# EAGLE design scd4x_rf-bm-2652p2 (EAGLE 9.6.2)
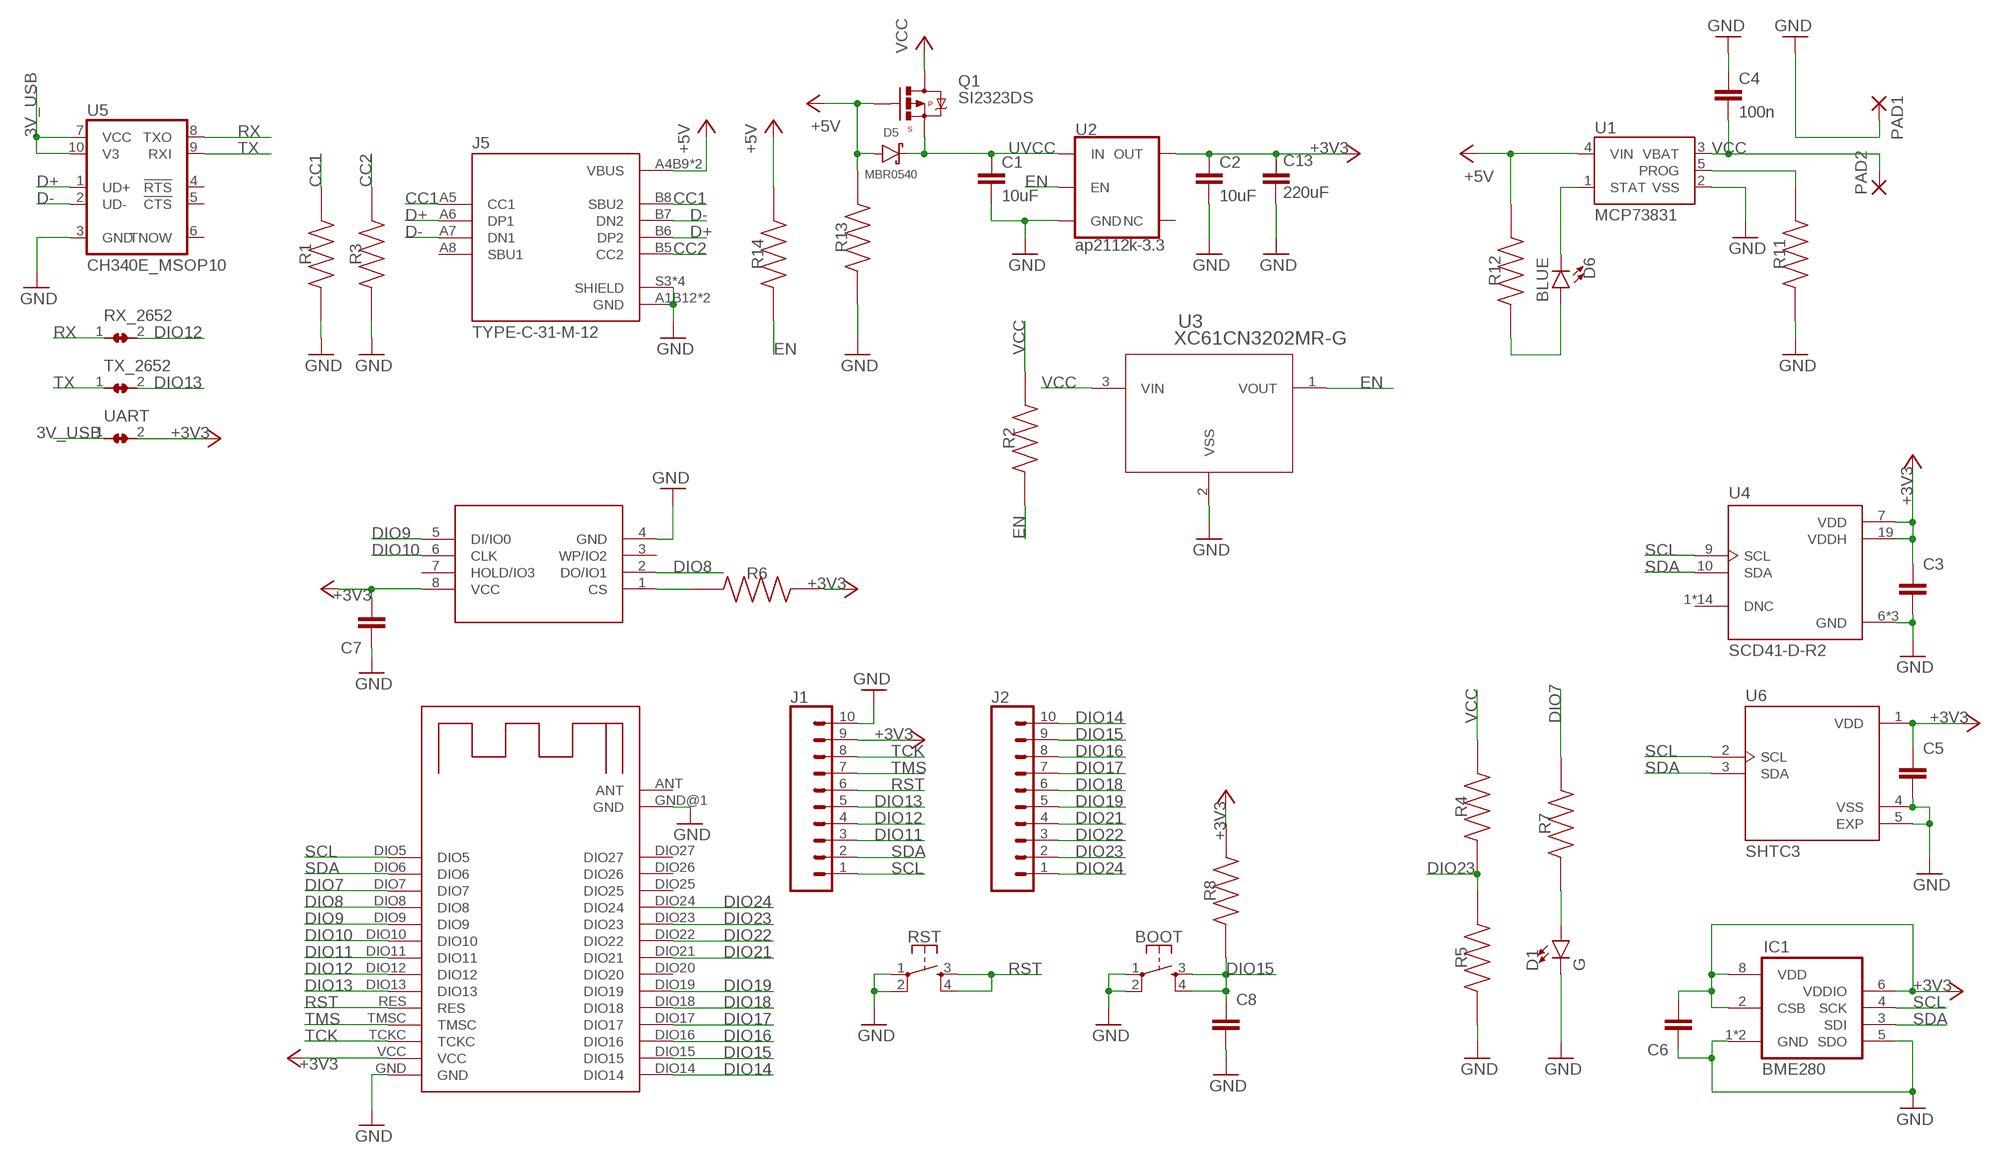
[diagram p0: schematic, sheet 1]

## Parts
BOOT  MOMENTARY-SWITCH-SPST-2-SMD-4.6X2.8MM  [TACTILE_SWITCH_SMD_4.6X2.8MM]
C1  10uF  10UF-0603-6.3V-20%  [0603]
C2  10uF  10UF-0603-6.3V-20%  [0603]
C3  100nF  CAP0402  [CAPC1005X40N]
C4  100n  10UF-0603-6.3V-20%  [0603]
C5  100nF  CAP0402  [CAPC1005X40N]
C6  100nF  CAP0402  [CAPC1005X40N]
C7  100n  CAP0402  [CAPC1005X40N]
C8  100nF  CAP0402  [CAPC1005X40N]
C13  220uF  C_TANTALUM-2917(7343-METRIC)  [CAPM7343X310]
D1  G  LED-BLUE0603  [LED-0603]
D5  MBR0540  DIODE-SCHOTTKY  [SOD-323]
D6  BLUE  LED-BLUE0603  [LED-0603]
IC1  BME280  [BME280]
J1  CONN_10NO_SILK_PTH_FEMALE  [1X10_NO_SILK]
J2  CONN_10NO_SILK_PTH_FEMALE  [1X10_NO_SILK]
J5  TYPE-C-31-M-12  [HRO_TYPE-C-31-M-12]
PAD1  WIREPADSMD1,27-254  [SMD1,27-2,54]
PAD2  WIREPADSMD1,27-254  [SMD1,27-2,54]
Q1  SI2323DS  MOSFET-PCHANNEL  [SOT23]
R1  5.1k  RC0402FR-073M6L  [RESC1005X40N]
R2  10k  RC0402FR-073M6L  [RESC1005X40N]
R3  5.1k  RC0402FR-073M6L  [RESC1005X40N]
R4  382k  RC0402FR-073M6L  [RESC1005X40N]
R5  382k  RC0402FR-073M6L  [RESC1005X40N]
R6  2.2k  RC0402FR-073M6L  [RESC1005X40N]
R7  2.2k  RC0402FR-073M6L  [RESC1005X40N]
R8  5.1M  RC0402FR-073M6L  [RESC1005X40N]
R11  2k  RC0402FR-073M6L  [RESC1005X40N]
R12  2.2k  RC0402FR-073M6L  [RESC1005X40N]
R13  100k  RC0402FR-073M6L  [RESC1005X40N]
R14  10k  RC0402FR-073M6L  [RESC1005X40N]
RST  MOMENTARY-SWITCH-SPST-2-SMD-4.6X2.8MM  [TACTILE_SWITCH_SMD_4.6X2.8MM]
RX_2652  RX_2652  SMALL_SOLDER_JUMPER_CLOSED  [SMALL_SOLDER_JUMPER_CLOSED]
TX_2652  TX_2652  SMALL_SOLDER_JUMPER_CLOSED  [SMALL_SOLDER_JUMPER_CLOSED]
U1  MCP73831  [SOT23-5]
U2  ap2112k-3.3  V_REG_AP2112K-3.3V  [SOT23-5]
U3  XC61CN3202MR-G  [XC61C_SOT-23_TOR]
U4  SCD41-D-R2  [XDCR_SCD41-D-R2]
U5  CH340E_MSOP10  [MSOP10]
U6  SHTC3  [SON100P200X200X80-5N]
U$1  RF-BM-2652P2  [RF-BM-2652P2]
U$3  MX25R8035FM1IL0  W25Q80BVSNIG  [SO-8]
UART  UART  SMALL_SOLDER_JUMPER_CLOSED  [SMALL_SOLDER_JUMPER_CLOSED]

## Nets
3V_USB: U5.7(VCC) U5.10(V3) UART.1
+3V3: C2.1 C3.1 C5.1 C6.2 C7.2 C13.1 IC1.2(CSB) IC1.6(VDDIO) IC1.8(VDD) J1.9 R6.2 R8.2 U2.5(OUT) U4.7(VDD) U4.19(VDDH) U6.1(VDD) U$1.VCC U$3.8(VCC) UART.2
+5V: D5.A J5.A4B9(VBUS) J5.B4A9(VBUS) Q1.1(G) R12.2 R13.2 R14.2 U1.4(VIN)
CC1: J5.A5(CC1) J5.B8(SBU2) R1.2
CC2: J5.B5(CC2) R3.2
D+: J5.A6(DP1) J5.B6(DP2) U5.1(UD+)
D-: J5.A7(DN1) J5.B7(DN2) U5.2(UD-)
DIO7: R7.2 U$1.DIO7
DIO8: U$1.DIO8 U$3.2(DO/IO1)
DIO9: U$1.DIO9 U$3.5(DI/IO0)
DIO10: U$1.DIO10 U$3.6(CLK)
DIO11: J1.3 U$1.DIO11
DIO12: J1.4 RX_2652.2 U$1.DIO12
DIO13: J1.5 TX_2652.2 U$1.DIO13
DIO14: J2.10 U$1.DIO14
DIO15: BOOT.3 BOOT.4 C8.1 J2.9 R8.1 U$1.DIO15
DIO16: J2.8 U$1.DIO16
DIO17: J2.7 U$1.DIO17
DIO18: J2.6 U$1.DIO18
DIO19: J2.5 U$1.DIO19
DIO21: J2.4 U$1.DIO21
DIO22: J2.3 U$1.DIO22
DIO23: J2.2 R4.1 R5.2 U$1.DIO23
DIO24: J2.1 U$1.DIO24
EN: R2.1 R14.1 U2.3(EN) U3.1(VOUT)
GND: BOOT.1 BOOT.2 C1.2 C2.2 C3.2 C4.1 C5.2 C6.1 C7.1 C8.2 C13.2 D1.C IC1.1(GND) IC1.5(SDO) IC1.7(GND) J1.10 J5.A1B12(GND) J5.B1A12(GND) J5.S3(SHIELD) J5.S4(SHIELD) J5.S5(SHIELD) J5.S6(SHIELD) PAD1.1(P) R1.1 R3.1 R5.1 R11.1 R13.1 RST.1 RST.2 U1.2(VSS) U2.2(GND) U3.2(VSS) U4.6(GND) U4.20(GND) U4.21(GND) U5.3(GND) U6.4(VSS) U6.5(EXP) U$1.GND U$1.GND@1(GND) U$3.4(GND)
N$1: D1.A R7.1
N$2: R6.1 U$3.1(CS)
N$8: R11.2 U1.5(PROG)
N$9: D6.A R12.1
N$11: D6.C U1.1(STAT)
RST: J1.6 RST.3 RST.4 U$1.RES
RX: RX_2652.1 U5.8(TXO)
SCL: IC1.4(SCK) J1.1 U4.9(SCL) U6.2(SCL) U$1.DIO5
SDA: IC1.3(SDI) J1.2 U4.10(SDA) U6.3(SDA) U$1.DIO6
TCK: J1.8 U$1.TCKC
TMS: J1.7 U$1.TMSC
TX: TX_2652.1 U5.9(RXI)
UVCC: C1.1 D5.C Q1.2(S) U2.1(IN)
VCC: C4.2 PAD2.1(P) Q1.3(D) R2.2 R4.2 U1.3(VBAT) U3.3(VIN)
Unconnected: J5.A8(SBU1) U2.4(NC) U4.1(DNC) U4.2(DNC) U4.3(DNC) U4.4(DNC) U4.5(DNC) U4.8(DNC) U4.11(DNC) U4.12(DNC) U4.13(DNC) U4.14(DNC) U4.15(DNC) U4.16(DNC) U4.17(DNC) U4.18(DNC) U5.4(!RTS) U5.5(!CTS) U5.6(TNOW) U$1.ANT U$1.DIO20 U$1.DIO25 U$1.DIO26 U$1.DIO27 U$3.3(WP/IO2) U$3.7(HOLD/IO3)

## Library data of the parts
BOOT RST = SparkFun-Switches:MOMENTARY-SWITCH-SPST-2: Momentary Switch (Pushbutton) - SPST - Two Circuits Normally-open (NO) SPST momentary switches (buttons, pushbuttons). Schematic symbol includes two switch circuits. Variants SMD-4.6MMX2.8MM - 4.60mm x 2.80mm Tactile Momentary Button Switch - Used on SparkFun SAMD21 Mini Breakout <https://www.sparkfun.com/products/13664> SMD-5.2MM - Mini Pushbutton Switch - SMD <https://www.sparkfun.com/products/8720> - Used on Arduino Pro Mini <https://www.sparkfun.com/products/11114>; PROD_ID: SWCH-13065
C1 C2 = SparkFun-Capacitors:10UF: 10.0µF ceramic capacitors A capacitor is a passive two-terminal electrical component used to store electrical energy temporarily in an electric field.; PROD_ID: CAP-11015
C3 C5-C8 = discretes-dev:CAP0402: CAP, 0402; AVAILABILITY: Good; DESCRIPTION: RESISTOR, 0402 0.063W 1% 3M6; Resistance:3.6Mohm; Resistance Tolerance:± 1%; Power Rating:0.063W; Voltage Rating:50V; Series:RC32H; Temperature Coefficient:± 100ppm/°C; Resistor Element Type:Thick Film; Resistor Case Style:0402; No. of Pins:2; SVHC:No SVHC; Case Style:0402; External Length / Height:1mm; Temperature Coeff. +:100ppm/°C; Temperature Coeff. -:100ppm/°C; External Depth:0.35mm; External Width:0.5mm; Operating Temperature Range:-55°C to +155°C; Overload Voltage:100V; MF: Yageo; MP: RC0402FR-073M6L; PACKAGE: 1005 Panasonic Electronic Components; PRICE: None; PURCHASE-URL: https://pricing.snapeda.com/search/part/RC0402FR-073M6L/?ref=eda
C4 = SparkFun-Capacitors:10UF: 10.0µF ceramic capacitors A capacitor is a passive two-terminal electrical component used to store electrical energy temporarily in an electric field.; PROD_ID: CAP-11015; VALUE: 10uF
C13 = Capacitor:C: Capacitor - Generic; CATEGORY: Capacitor
D1 = SparkFun-LED:LED-BLUE: Blue SMD LED Used in manufacturing of various products at SparkFun Packages: 0603 - SMD 0603 package [Product Link] <http://www.digikey.com/product-detail/en/SMLE12BC7TT86/511-1589-2-ND/1641808> 1206 - SMD1206 package [Product Link] <http://www.digikey.com/product-detail/en/lite-on-inc/LTST-C150TBKT/160-1643-1-ND/573584> SparkFun Products: ESP8266 Thing-Dev Board <https://www.sparkfun.com/products/13711> RedBoard <https://www.sparkfun.com/products/12757>; PROD_ID: DIO-08575; VALUE: BLUE
D5 = pimoroni-passives:DIODE-SCHOTTKY
D6 = SparkFun-LED:LED-BLUE: Blue SMD LED Used in manufacturing of various products at SparkFun Packages: 0603 - SMD 0603 package [Product Link] <http://www.digikey.com/product-detail/en/SMLE12BC7TT86/511-1589-2-ND/1641808> 1206 - SMD1206 package [Product Link] <http://www.digikey.com/product-detail/en/lite-on-inc/LTST-C150TBKT/160-1643-1-ND/573584> SparkFun Products: ESP8266 Thing-Dev Board <https://www.sparkfun.com/products/13711> RedBoard <https://www.sparkfun.com/products/12757>; PROD_ID: DIO-08575
IC1 = bosch-bme280:BME280: DIGITAL HUMIDITY, PRESSURE AND TEMPERATURE SENSOR * Digital interface I²C (up to 3.4 MHz) and SPI (3 and 4 wire, up to 10 MHz)* Supply voltage VDD main supply voltage range: 1.71 V to 3.6 V*VDDIO interface voltage range: 1.2 V to 3.6 V Operating range -40…+85 °C, 0…100 % rel. humidity, 300…1100 hPa The library has been designed by Richard Magdycz <https://www.facebook.com/groups/eaglecadsoftUK>
J1 J2 = SparkFun-Connectors2:CONN_10: Multi connection point. Often used as Generic Header-pin footprint for 0.1 inch spaced/style header connections On any of the 0.1 inch spaced packages, you can populate with these: Break Away Headers - Straight <https://www.sparkfun.com/products/116> (PRT-00116) Break Away Male Headers - Right Angle <https://www.sparkfun.com/products/553> (PRT-00553) Female Headers <https://www.sparkfun.com/products/115> (PRT-00115) Break Away Headers - Machine Pin <https://www.sparkfun.com/products/117> (PRT-00117) Break Away Female Headers - Swiss Machine Pin <https://www.sparkfun.com/products/743> (PRT-00743) Arduino Stackable Header - 10 Pin <https://www.sparkfun.com/products/11376> (PRT-11376) For SCREWTERMINALS and SPRING TERMINALS visit here: Screw Terimnals on SparkFun.com <https://www.sparkfun.com/search/results?term=Screw+Terminals> (5mm/3.5mm/2.54mm spacing) This device is also useful as a general connection point to wire up your design to another part of your project. Our various solder wires solder well into these plated through hole pads. Hook-Up Wire - Assortment (Stranded, 22 AWG) <https://www.sparkfun.com/products/11375> (PRT-11375) Hook-Up Wire - Assortment (Solid Core, 22 AWG) <https://www.sparkfun.com/products/11367> (PRT-11367) View the entire wire category on our website here <https://www.sparkfun.com/categories/141> Special notes: Molex polarized connector foot print use with SKU : PRT-08231 with associated crimp pins and housings. 1MM SMD Version SKU: PRT-10208 NOTES ON THE VARIANTS LOCK and LOCK_LONGPADS... This footprint was designed to help hold the alignment of a through-hole component (i.e. 6-pin header) while soldering it into place. You may notice that each hole has been shifted either up or down by 0.005 of an inch from it's more standard position (which is a perfectly straight line). This slight alteration caused the pins (the squares in the middle) to touch the edges of the holes. Because they are alternating, it causes a "brace" to hold the component in place. 0.005 has proven to be the perfect amount of "off-center" position when using our standard breakaway headers. Although looks a little odd when you look at the bare footprint, once you have a header in there, the alteration is very hard to notice. Also,if you push a header all the way into place, it is covered up entirely on the bottom side.; PROD_ID: CONN-11563
J5 = TYPE-C-31-M-12:TYPE-C-31-M-12: USB Connectors 24 Receptacle 1 8.94*7.3mm RoHS Check availability <https://pricing.snapeda.com/parts/TYPE-C-31-M-12/HRO%20Electronics%20Co.%2C%20Ltd./view-part?ref=eda>; AVAILABILITY: Not in stock; DESCRIPTION: USB Connectors 24 Receptacle 1 8.94*7.3mm RoHS; MF: HRO Electronics Co., Ltd.; MP: TYPE-C-31-M-12; PACKAGE: Package; PRICE: None
PAD1 PAD2 = wirepad:WIREPAD: Wire PAD connect wire on PCB
Q1 = pimoroni-passives:MOSFET-PCHANNEL: Generic PMOSFET
R1-R8 R11-R14 = RC0402FR-073M6L:RC0402FR-073M6L: RESISTOR, 0402 0.063W 1% 3M6; Resistance:3.6Mohm; Resistance Tolerance:± 1%; Power Rating:0.063W; Voltage Rating:50V; Series:RC32H; Temperature Coefficient:± 100ppm/°C; Resistor Element Type:Thick Film; Resistor Case Style:0402; No. of Pins:2; SVHC:No SVHC; Case Style:0402; External Length / Height:1mm; Temperature Coeff. +:100ppm/°C; Temperature Coeff. -:100ppm/°C; External Depth:0.35mm; External Width:0.5mm; Operating Temperature Range:-55°C to +155°C; Overload Voltage:100V Check prices <https://pricing.snapeda.com/parts/RC0402FR-073M6L/Yageo/view-part?ref=eda>; AVAILABILITY: Good; DESCRIPTION: RESISTOR, 0402 0.063W 1% 3M6; Resistance:3.6Mohm; Resistance Tolerance:± 1%; Power Rating:0.063W; Voltage Rating:50V; Series:RC32H; Temperature Coefficient:± 100ppm/°C; Resistor Element Type:Thick Film; Resistor Case Style:0402; No. of Pins:2; SVHC:No SVHC; Case Style:0402; External Length / Height:1mm; Temperature Coeff. +:100ppm/°C; Temperature Coeff. -:100ppm/°C; External Depth:0.35mm; External Width:0.5mm; Operating Temperature Range:-55°C to +155°C; Overload Voltage:100V; MF: Yageo; MP: RC0402FR-073M6L; PACKAGE: 1005 Panasonic Electronic Components; PRICE: None; PURCHASE-URL: https://pricing.snapeda.com/search/part/RC0402FR-073M6L/?ref=eda
RX_2652 TX_2652 UART = pimoroni-misc:SMALL_SOLDER_JUMPER_CLOSED
U1 = SparkFun-IC-Power:MCP73831: MCP73831T Li-Ion, Li-Pol Controller Miniature single cell, fully integrated Li-Ion, Li-polymer charge management controller Datasheet <http://ww1.microchip.com/downloads/en/DeviceDoc/20001984g.pdf> SparkFun Products: SparkFun ESP32 Thing <https://www.sparkfun.com/products/13907> SparkFun 9DoF Razor IMU M0 <https://www.sparkfun.com/products/14001>; PROD_ID: IC-09995
U2 = SparkFun-IC-Power:V_REG_AP2112: AP2112 - 600mA CMOS LDO Regulator w/ Enable The AP2112 is CMOS process low dropout linear regulator with enable function, the regulator delivers a guaranteed 600mA (min.) continuous load current. Features Output Voltage Accuracy: ±1.5% Output Current: 600mA (Min.) Foldback Short Current Protection: 50mA Enable Function to Turn ON/OFF VOUT Low Dropout Voltage (3.3V): 250mV (Typ.) @IOUT=600mA Excellent Load Regulation: 0.2%/A (Typ.) Excellent Line Regulation: 0.02%/V (Typ.) Low Quiescent Current: 55μA (Typ.) Low Standby Current: 0.01μA (Typ.) Low Output Noise: 50μVRMS PSRR: 100Hz -65dB, 1kHz -65dB OTSD Protection Stable with 1.0μF Flexible Cap: Ceramic, Tantalum and Aluminum Electrolytic Operation Temperature Range: -40°C to 85°C ESD: MM 400V, HBM 4000V; PROD_ID: VREG-12457; VALUE: 3.3V
U3 = XC61CN3202MRG:XC61CN3202MR-G; BUILT_BY: EMA_UL_Team; MANUFACTURER_PART_NUMBER: XC61CN3202MR-G; SOURCELIBRARY: Torex_2016-06-30_2; VENDOR: Torex Semiconductor
U4 = SCD41-D-R2:SCD41-D-R2: Check availability <https://pricing.snapeda.com/parts/SCD41-D-R2/Sensirion%20AG/view-part?ref=eda>; AVAILABILITY: In Stock; DESCRIPTION: Air Quality Sensor CO2 Sensor 2.5V/3.3V/5V 20-Pin SMD EP; MF: Sensirion AG; MP: SCD41-D-R2; PACKAGE: None; PRICE: None; PURCHASE-URL: https://pricing.snapeda.com/search/part/SCD41-D-R2/?ref=eda
U5 = CH340E:CH340E: Check prices <https://pricing.snapeda.com/parts/CH340E/WCH/view-part?ref=eda>; AVAILABILITY: Not in stock; DESCRIPTION: USB to serial chip CH340; MF: WCH; MP: CH340E; PACKAGE: Package; PRICE: None
U6 = SHTC3:SHTC3: SENSOR HUMI/TEMP I2C 2% SMD Check availability <https://pricing.snapeda.com/parts/SHTC3/Sensirion%20AG/view-part?ref=eda>; AVAILABILITY: In Stock; DESCRIPTION: SENSOR HUMI/TEMP I2C 2% SMD; MF: Sensirion AG; MP: SHTC3; PACKAGE: DFN-4 Sensirion; PRICE: None; PURCHASE-URL: https://pricing.snapeda.com/search/part/SHTC3/?ref=eda
U$1 = E72-2G4M20S1E:RF-BM-2652P2
U$3 = W25Q80BVSNIG:W25Q80BVSNIG: Check availability <https://pricing.snapeda.com/parts/W25Q80BVSNIG/Winbond%20Electronics/view-part?ref=eda>; AVAILABILITY: In Stock; DESCRIPTION: FLASH - NOR Memory IC 8Mb (1M x 8) SPI - Quad I/O 104 MHz 8-SOIC; MF: Winbond Electronics; MP: W25Q80BVSNIG; PACKAGE: SOIC-8 Winbond; PRICE: None

## Board
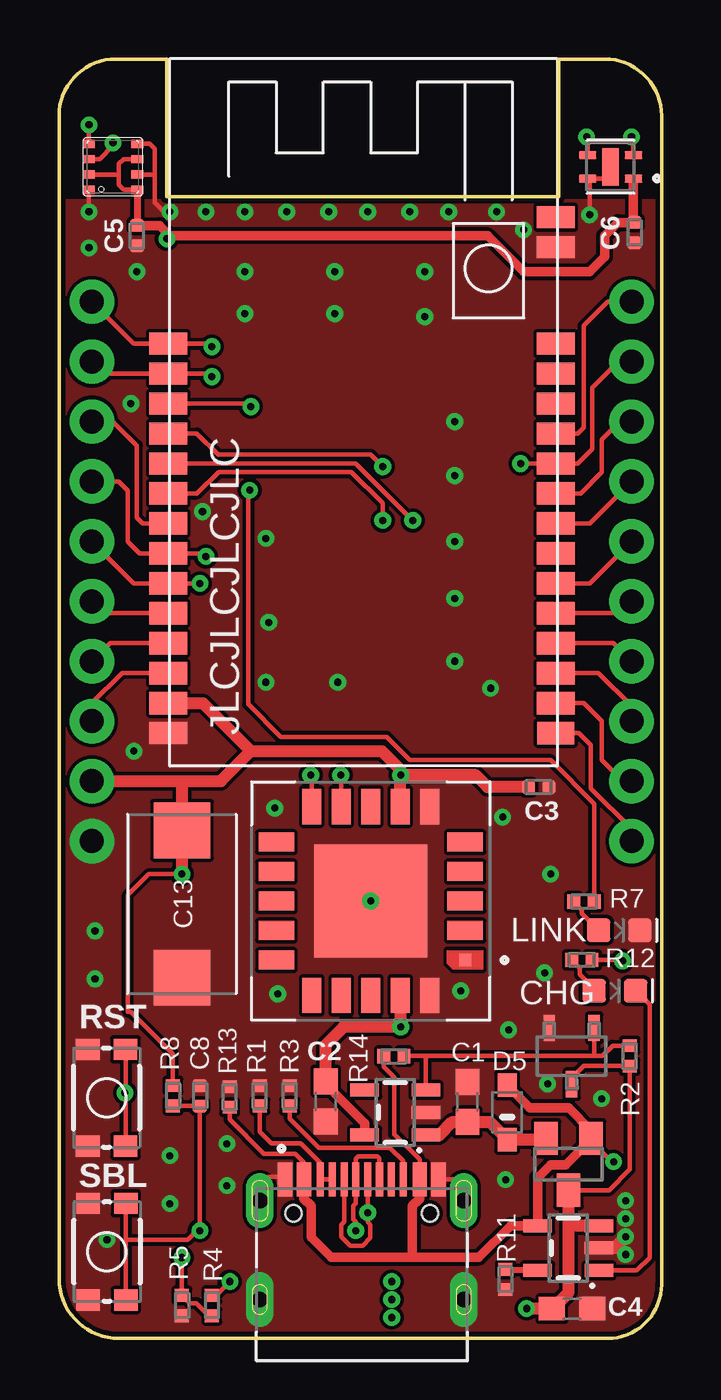
[diagram p1: board, top side]
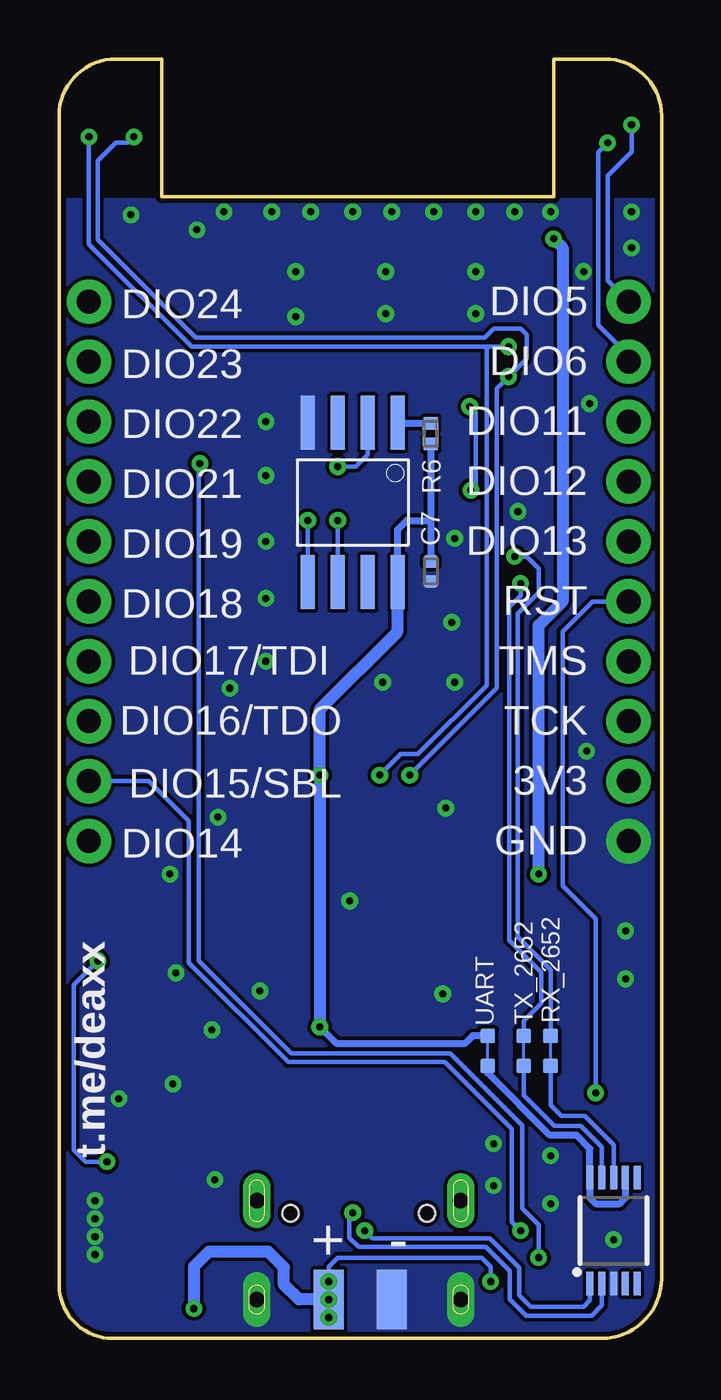
[diagram p2: board, bottom side, seen from below]

Size 25.53 x 54.23 mm. Coordinates in mm from the lower left corner, seen from the top.
Outline: 23.11,54.23 arc-90 25.53,51.82 25.53,2.29 arc-90 23.24,0 2.54,0 arc-90 0,2.54 0,51.82 arc-90 2.41,54.23 4.57,54.23 4.57,48.39 21.17,48.39 21.17,54.23 23.11,54.23
Copper layers (1*16): Top 0.035mm / dielectric 1.5mm / Bottom 0.035mm
Design rules "default *": minimum track width 0.2mm, minimum drill 0.3mm, track to track 6mil, track to pad 6mil, pad to pad 4mil, via to via 6mil, smd to smd 6mil, copper to edge 0.2mm, drill to drill 0.3mm, minimum pad ring 10mil, minimum via ring 8mil, stop-mask expansion 2mil, vias tented up to drill 0.3mm, thermal gap 10mil
bRestrict: area 4.3,11.9 to 5.1,12.4; area 5.5,11.9 to 6.2,12.4; area 7,11.9 to 7.7,12.4

### Footprints (pad centres in the part's own frame; a part is rotated, then mirrored left to right if it is on the bottom)
TACTILE_SWITCH_SMD_4.6X2.8MM = smd 0.9 x 1: 1 -2.05,-0.8; 2 2.05,-0.8; 3 2.05,0.8; 4 -2.05,0.8
0603 = smd 1.1 x 1: 1 -0.85,0; 2 0.85,0
CAPC1005X40N = smd 0.54 x 0.6: 1 -0.432,0; 2 0.432,0
CAPM7343X310 = smd 2.368 x 2.404: 1 -3.121,0; 2 3.121,0
LED-0603 = smd 1 x 1: A -0.877,0; C 0.877,0
SOD-323 = smd 1 x 0.8: A 1.15,0; C -1.15,0
BME280 = smd 0.35 x 0.5: 1 0.975,-1.025; 2 0.325,-1.025; 3 -0.325,-1.025; 4 -0.975,-1.025; 5 -0.975,1.025; 6 -0.325,1.025; 7 0.325,1.025; 8 0.975,1.025
1X10_NO_SILK = drill 1.016 pad 1.88: 1 0,0; 2 2.54,0; 3 5.08,0; 4 7.62,0; 5 10.16,0; 6 12.7,0; 7 15.24,0; 8 17.78,0; 9 20.32,0; 10 22.86,0
HRO_TYPE-C-31-M-12 = smd 0.6 x 1.45: A1B12 -3.25,5.095; A4B9 -2.45,5.095; B1A12 3.25,5.095; B4A9 2.45,5.095 | smd 0.3 x 1.45: A5 -1.25,5.095; A6 -0.25,5.095; A7 0.25,5.095; A8 1.25,5.095; B5 1.75,5.095; B6 0.75,5.095; B7 -0.75,5.095; B8 -1.75,5.095 | drill 0.65 pad 1.05 long: S1 -4.313,4.182; S2 4.318,4.187; S3 -4.32,0; S4 4.32,0; S5 -4.315,4.191; S6 4.318,4.18 | hole 0.7: -2.89,3.65; 2.89,3.65
SMD1,27-2,54 = smd 1.27 x 2.54: 1 0,0
SOT23 = smd 1 x 1.4: 1 -0.95,-1.1; 2 0.95,-1.1; 3 0,1.1
RESC1005X40N = smd 0.54 x 0.6: 1 -0.432,0; 2 0.432,0
SMALL_SOLDER_JUMPER_CLOSED = smd 0.635 x 0.635: 1 -0.635,0; 2 0.635,0
SOT23-5 = smd 0.55 x 1.2: 1 -0.95,-1.3; 2 0,-1.3; 3 0.95,-1.3; 4 0.95,1.3; 5 -0.95,1.3
XC61C_SOT-23_TOR = smd 0.483 x 1.118: 1 -0.95,-1.194; 2 0.95,-1.194; 3 0,1.194
XDCR_SCD41-D-R2 = smd 0.5 x 0.5: 1 -4,2.5 | smd 1.5 x 0.8: 2 -4,1.25; 3 -4,0; 4 -4,-1.25; 5 -4,-2.5; 11 4,-2.5; 12 4,-1.25; 13 4,0; 14 4,1.25; 15 4,2.5 | smd 0.8 x 1.5: 6 -2.5,-4; 7 -1.25,-4; 8 0,-4; 9 1.25,-4; 10 2.5,-4; 16 2.5,4; 17 1.25,4; 18 0,4; 19 -1.25,4; 20 -2.5,4 | smd 4.8 x 4.8: 21 0,0
MSOP10 = smd 1 x 0.3: 1 -2.25,1; 2 -2.25,0.5; 3 -2.25,0; 4 -2.25,-0.5; 5 -2.25,-1; 6 2.25,-1; 7 2.25,-0.5; 8 2.25,0; 9 2.25,0.5; 10 2.25,1
SON100P200X200X80-5N = smd 0.75 x 0.35: 1 -0.97,0.5; 2 -0.97,-0.5; 3 0.97,-0.5; 4 0.97,0.5 | smd 0.7 x 1.6: 5 0,0
RF-BM-2652P2 = smd 1.6 x 0.94: ANT 16.346,23.27; DIO5 -0.073,17.91; DIO6 -0.073,16.64; DIO7 -0.073,15.37; DIO8 -0.073,14.1; DIO9 -0.073,12.83; DIO10 -0.073,11.56; DIO11 -0.073,10.29; DIO12 -0.073,9.02; DIO13 -0.073,7.75; DIO14 16.346,1.4; DIO15 16.346,2.67; DIO16 16.346,3.94; DIO17 16.346,5.21; DIO18 16.346,6.48; DIO19 16.346,7.75; DIO20 16.346,9.02; DIO21 16.346,10.29; DIO22 16.346,11.56; DIO23 16.346,12.83; DIO24 16.346,14.1; DIO25 16.346,15.37; DIO26 16.346,16.64; DIO27 16.346,17.91; GND -0.073,1.4; GND@1 16.346,22; RES -0.073,6.48; TCKC -0.073,3.94; TMSC -0.073,5.21; VCC -0.073,2.67
SO-8 = smd 2.286 x 0.61: 1 -3.378,1.27; 2 -3.378,0; 3 -3.378,-1.27; 4 -3.378,-2.54; 5 3.378,-2.54; 6 3.378,-1.27; 7 3.378,0; 8 3.378,1.27

### Placement (x,y rotation side)
BOOT  2.03,3.68 270 top
C1  17.3,10.03 90 top
C2  11.3,10.05 270 top
C3  20.32,23.37 0 top
C4  21.73,1.26 180 top
C5  3.3,46.74 270 top
C6  24.38,46.86 90 top
C7  9.78,32.51 90 bottom
C8  5.97,10.29 90 top
C13  5.21,18.42 270 top
D1  23.74,17.3 0 top
D5  18.98,9.58 90 top
D6  23.55,14.74 0 top
IC1  2.29,49.66 270 top
J1  1.4,43.94 270 top
J2  24.26,43.94 270 top
J5  12.83,1.65 0 top
PAD1  11.43,1.65 0 bottom
PAD2  14.1,1.65 0 bottom
Q1  21.59,7.39 180 top
R1  8.51,10.29 270 top
R2  24.18,11.98 270 top
R3  9.78,10.29 270 top
R4  6.48,1.4 90 top
R5  5.21,1.4 90 top
R6  9.78,38.35 270 bottom
R7  22.24,18.51 0 top
R8  4.83,10.29 90 top
R11  18.91,2.5 90 top
R12  22.16,16.04 0 top
R13  7.23,10.24 270 top
R14  14.19,11.97 180 top
RST  2.02,10.21 270 top
RX_2652  4.7,12.19 90 bottom
TX_2652  5.84,12.19 90 bottom
U1  21.58,3.83 90 top
U2  14.25,9.58 90 top
U3  21.72,11.97 180 top
U4  13.21,18.54 180 top
U5  2.03,4.57 90 bottom
U6  23.37,49.66 180 top
U$1  4.7,24.26 0 top
U$3  12.45,35.43 270 bottom
UART  7.37,12.19 90 bottom

### Tracks (layer width: path | path; a pad name or v marks a point on that pad's centre or on a via)
3V_USB
  Bottom 0.305: U5.7 1.53,5.96 1.78,5.71 2.79,5.71 3.03,5.95 U5.10 3.03,8.05 3.6,8.61 4.72,8.61 7.37,11.25 UART.1
+3V3  (via drill 0.3)
  Top 0.2: IC1.8 2.75,48.68 2.54,48.89 2.54,49.4 | 2.54,49.4 2.54,49.78 2.74,49.98 IC1.6 | IC1.2 2.47,49.33 2.54,49.4 | R8.2 4.83,12.06 3.05,13.84 2.92,13.84 2.92,18.8 3.81,19.69 v5.21,19.69
  Top 0.305: 3.3,48.67 IC1.8 3.31,47.18 C5.1 | C6.2 24.46,47.37
  Top 0.406: C2.1 11.3,10.77 12.95,9.13 U2.5 | C5.1 4.27,47.17 4.7,46.74 | U6.1 24.34,47.34 C6.2 23.67,47.29 23.11,46.74 23.11,45.85 22.48,45.21 19.68,45.21 18.16,46.74 4.7,46.74 | v4.57,46.61 4.7,46.74
  Top 0.508: U4.19 14.46,13.23 | 14.46,13.23 v14.48,13.21 | C2.1 11.3,12.45 12.09,13.23 14.46,13.23 | U4.7 14.46,23.86 | 14.46,23.86 14.46,24.11 13.68,24.89 8.13,24.89 | 14.46,23.86 v14.48,23.88 17.65,23.88 18.16,23.37 C3.1 | J1.9 5.21,23.62 | 5.21,23.62 6.86,23.62 8.13,24.89 | 5.21,23.62 C13.1 v5.21,19.69 | U$1.VCC 6.09,26.93 8.13,24.89
  Bottom 0.305: R6.2 9.78,34.67 | 9.78,34.67 C7.2 9.86,32.94 | U$3.8 11.18,34.29 10.79,34.67 9.78,34.67 | v14.48,13.21 13.79,12.52 8.31,12.52 8,12.83 UART.2
  Bottom 0.508: v14.48,13.21 v14.48,23.88 14.48,26.67 11.18,29.97 U$3.8 | v5.21,19.69 5.21,30.23 4.19,31.24 4.19,46.23 v4.57,46.61
+5V  (via drill 0.3)
  Top 0.2: R14.2 13.75,11.52 14.2,11.07 14.2,8.66 15.28,7.58 J5.B4A9 | Q1.1 22.54,8.36 23.41,7.49 v23.5,7.49 | R12.2 23.83,16.04 v23.88,16 | J5.A4B9 10.38,7.46 10,7.83 8.68,7.83 7.23,9.28 R13.2
  Top 0.406: D5.A 19.94,9.78 21.59,9.78 22.54,8.83 Q1.1 22.54,8.44 21.46,7.37 20.83,7.37 20.28,6.82 U1.4 19.14,4.78 17.79,3.44 14.94,3.44 | J5.A4B9 10.38,5.93 10.69,5.61 10.69,4.3 11.54,3.44 14.94,3.44 | J5.B4A9 15.28,5.93 14.96,5.61 14.96,3.46 14.94,3.44
  Bottom 0.2: v23.5,7.49 24.38,7.49 24.89,8 24.89,14.99 v23.88,16
CC1
  Top 0.2: J5.A5 J5.B8 11.08,7.45 10.25,8.27 9,8.27 8.51,8.76 R1.2
CC2
  Top 0.2: J5.B5 14.58,7.52 14.02,8.08 11.01,8.08 9.78,9.31 R3.2
D+  (via drill 0.3)
  Top 0.2: v12.57,4.57 12.57,4.94 12.46,5.04 12.46,5.62 12.57,5.73 J5.A6 12.58,7.62 12.68,7.72 13.49,7.72 13.58,7.63 J5.B6
  Bottom 0.2: U5.1 3.03,1.61 3.3,1.34 5.53,1.34 6.02,1.83 6.02,2.99 7.28,4.25 12.26,4.25 v12.57,4.57
D-  (via drill 0.3)
  Top 0.2: J5.A7 v13.08,5.34 v13.08,5.33 13.08,4.94 13.19,4.83 13.19,4.26 12.86,3.93 12.33,3.93 11.96,4.3 11.96,4.83 12.08,4.95 J5.B7
  Bottom 0.2: U5.2 2.53,1.41 2.96,0.97 5.74,0.97 6.42,1.66 6.42,2.87 7.44,3.88 12.83,3.88 13.22,4.28 13.22,5.19 v13.08,5.33
DIO7  (via drill 0.3)
  Top 0.2: R7.2 22.68,22.66 20.83,24.51 14.86,24.51 13.88,25.5 9.4,25.5 8.01,26.89 8.01,35.88 v8.07,35.95 | v8.13,39.5 8,39.63 U$1.DIO7
  Bottom 0.2: v8.13,39.5 7.87,39.24 7.87,36.15 v8.07,35.95
DIO8  (via drill 0.3)
  Top 0.2: U$1.DIO8 5.84,38.36 6.74,37.46 13.21,37.46 v13.72,36.96
  Bottom 0.2: v13.72,36.96 12.95,36.96 12.45,37.46 U$3.2
DIO9  (via drill 0.3)
  Top 0.2: U$1.DIO9 12.57,37.09 v14.99,34.67
  Bottom 0.2: v14.99,34.67 U$3.5
DIO10  (via drill 0.3)
  Top 0.2: U$1.DIO10 5.84,35.82 6.76,36.73 12.39,36.73 13.72,35.41 v13.72,34.67
  Bottom 0.2: v13.72,34.67 U$3.6
DIO11
  Top 0.2: U$1.DIO11 3.55,34.55 3.3,34.8 3.3,37.85 2.29,38.86 J1.3
DIO12  (via drill 0.3)
  Top 0.2: J1.4 2.54,36.32 2.92,35.94 2.92,33.78 3.43,33.28 U$1.DIO12 6.09,33.28 v6.22,33.15
  Bottom 0.2: v6.22,33.15 5.71,33.15 5.21,32.64 5.21,31.62 6.1,30.73 6.1,17.02 4.7,15.62 RX_2652.2
DIO13  (via drill 0.3)
  Top 0.2: J1.5 3.17,32.01 U$1.DIO13 v5.97,32.01 v5.97,32
  Bottom 0.2: v5.97,32 5.97,31.5 6.46,31 6.46,16.88 5.1,15.51 5.1,14.21 5.84,13.46 TX_2652.2
DIO14
  Top 0.2: U$1.DIO14 22.02,25.66 22.53,25.15 22.53,23.32 24.26,21.59 J2.10
DIO15  (via drill 0.3)
  Top 0.2: U$1.DIO15 22.22,26.93 22.99,26.16 22.99,24.51 23.88,23.62 J2.9 | BOOT.4 2.83,4.19 | 2.83,4.19 BOOT.3 | 2.83,4.19 5.46,4.19 5.84,4.57 v5.97,4.57 C8.1 R8.1
  Bottom 0.2: v5.97,4.57 6.35,4.95 6.35,8.89 9.18,11.72 15.82,11.72 20.03,15.92 20.03,21.93 21.72,23.62 J2.9
DIO16
  Top 0.2: U$1.DIO16 22.86,28.2 24.26,26.8 J2.8
DIO17
  Top 0.2: U$1.DIO17 23.49,29.47 J2.7
DIO18
  Top 0.2: U$1.DIO18 23.75,30.74 J2.6
DIO19
  Top 0.2: U$1.DIO19 22.48,32.01 J2.5
DIO21
  Top 0.2: U$1.DIO21 22.48,34.55 J2.4
DIO22
  Top 0.2: U$1.DIO22 22.1,35.82 23,36.71 23,38.09 23.77,38.86 J2.3
DIO23  (via drill 0.3)
  Top 0.2: J2.2 23.7,41.4 22.58,40.29 22.58,37.7 21.97,37.09 U$1.DIO23 v19.56,37.08 | v5.21,3.43 R5.2 5.54,1.5 5.82,1.5 6.35,0.96 R4.1
  Bottom 0.2: v5.21,3.43 5.21,4.83 5.9,5.52 5.9,9.03 8.96,12.08 15.69,12.08 19.61,16.01 19.61,37.03 v19.56,37.08
DIO24
  Top 0.2: U$1.DIO24 21.97,38.36 22.23,38.61 22.23,42.93 23.24,43.94 J2.1
EN
  Top 0.2: 22.67,12.76 U3.1 22.67,12.03 22.73,11.97 | R14.1 15.62,11.97 | 15.62,11.97 22.73,11.97 | 22.73,11.97 23.02,11.97 23.46,12.41 R2.1 | U2.3 15.55,11.89 15.62,11.97
GND  (via drill 0.3)
  Top 0.2: IC1.1 1.27,48.67 v1.27,47.75 | IC1.5 3.85,50.63 4.06,50.42 4.06,49.28 | 4.06,49.28 4.06,48.13 4.45,47.75 v4.7,47.75 | IC1.7 4.01,49.33 4.06,49.28 | U6.5 23.37,49.15 23.36,49.16 U6.4 22.48,49.08 v22.48,47.62 | J5.S6 17.14,6.73 | 17.14,6.73 | 17.14,6.73 17.13,6.75 J5.B1A12 | J5.S5 8.51,6.48 8.89,6.86 9.46,6.86 J5.A1B12
  Top 0.508: v24,3.56 23.73,3.83 U1.2 23.52,3.83 v24,4.32
  other vias: 24,5.08 24,5.84 3.17,24.89 6.22,47.75 7.87,47.75 9.65,47.75 11.43,47.75 13.08,47.75 14.86,47.75 16.51,47.75 18.54,47.75 19.68,46.99 1.27,46.23 3.3,45.21 3.05,39.62 7.87,45.21 11.68,45.21 15.49,45.21 16.76,28.7 16.76,33.78 16.76,38.86 16.76,31.37 1.52,17.27 19.05,13.08 17.02,14.73 9.27,14.61 20.7,10.79 22.99,10.16 18.92,6.73 2.03,4.19 7.11,8.25 7.11,6.48 20.57,15.49 20.83,19.69 18.8,22.1 18.29,27.56 8.76,27.81 8.89,30.35 8.76,33.91 6.08,35.05 11.81,27.81 16.76,36.58 7.87,43.43 11.68,43.43 15.49,43.31 13.21,18.54 9.14,22.48 1.52,15.24 4.7,7.75 4.7,5.71
  pour Bottom (no thermals): -0.22,48.26 -0.22,-0.15 25.68,-0.15 25.68,48.26
  pour Top (no thermals): -0.42,48.26 25.88,48.26 25.88,-0.25 -0.42,-0.25
N$1
  Top 0.2: R7.1 22.16,18.17 22.16,18.02 D1.A
N$2
  Bottom 0.305: R6.1 11.15,38.79 U$3.1
N$8
  Top 0.254: U1.5 18.96,2.88 R11.2
N$9
  Top 0.2: R12.1 22.07,15.7 22.07,15.42 22.68,14.81 D6.A
N$11
  Top 0.2: U1.1 24.47,2.88 25.02,3.43 25.02,14.15 D6.C
RST  (via drill 0.3)
  Top 0.2: RST.4 2.82,10.44 v2.79,10.41 2.82,10.39 RST.3 | U$1.RES 1.9,30.74 J1.6
  Bottom 0.2: v2.79,10.41 2.79,17.78 4.19,19.18 4.19,29.97 2.92,31.24 J1.6
RX
  Bottom 0.2: U5.8 2.03,8.21 3.25,9.43 4.24,9.43 4.7,9.88 RX_2652.1
SCL  (via drill 0.3)
  Top 0.2: J1.1 3.17,42.17 U$1.DIO5 6.35,42.17 v6.48,42.04 | U4.9 11.96,23.86 v11.94,23.88 | IC1.4 v1.26,51.43 v1.27,51.43 | U6.2 24.34,50.85 v24.26,50.93
  Bottom 0.2: v11.94,23.88 11.05,24.77 10.32,24.77 7.41,27.68 7.41,41.95 7.49,42.04 | 6.6,42.04 v6.48,42.04 7.49,42.04 | J1.1 2.29,44.83 2.29,49.28 1.27,50.29 v1.27,51.43 | 7.49,42.04 19.91,42.04 24.26,46.38 v24.26,50.93
SDA  (via drill 0.3)
  Top 0.2: v2.29,50.67 2.29,50.55 1.72,49.98 IC1.3 | J1.2 1.9,40.9 U$1.DIO6 6.35,40.9 v6.48,40.77 | U4.10 10.71,23.84 v10.67,23.88 | U6.3 22.4,50.88 v22.35,50.93
  Bottom 0.2: v10.67,23.88 6.99,27.56 6.99,40.26 v6.48,40.77 5.71,41.53 5.71,42.54 5.97,42.8 7.11,42.8 7.49,42.42 19.73,42.42 23.88,46.56 23.88,49.91 23.11,50.67 22.61,50.67 v22.35,50.93 | v2.29,50.67 2.69,50.27 2.69,42.95 1.4,41.66 J1.2
TCK
  Top 0.2: U$1.TCKC 2.67,28.2 1.4,26.92 J1.8
TMS
  Top 0.2: U$1.TMSC 2.16,29.47 J1.7
TX
  Bottom 0.2: U5.9 2.53,8.12 3.43,9.02 4.55,9.02 5.84,10.31 TX_2652.1
UVCC
  Top 0.508: U2.1 16.12,8.63 16.67,9.17 C1.1 18.24,9.17 D5.C 20.58,8.43 Q1.2
VCC  (via drill 0.3)
  Top 0.2: Q1.3 23.31,6.29 24.18,7.16 R2.2 24.17,11.56 22.23,11.56 21.72,11.05 U3.3 | R4.2 6.66,1.83 v7.24,2.41
  Top 0.508: Q1.3 21.59,4.83 | 21.59,4.83 21.59,1.97 C4.2 19.82,1.26 v19.81,1.27 | 21.59,4.83 21.63,4.78 U1.3
  Top 0.61: C4.2 20.77,1.14
  Bottom 0.2: v7.24,2.41 7.24,3.05 7.62,3.43 13.72,3.43 14.1,3.05 v14.1,2.41 | 14.1,1.52 v14.1,0.89
  Bottom 0.406: 14.1,1.52 PAD2.1 v14.1,2.41
  Bottom 0.508: v19.81,1.27 19.81,3.05 19.18,3.68 16.67,3.68 16,3.02 16,2.29 15.37,1.65 PAD2.1
  other vias: 14.1,1.65

### Text on the board
tNames: JLCJLCJLCJLC | LINK | CHG | RST | SBL
bNames: DIO5 | DIO24 | DIO6 | DIO23 | DIO11 | DIO22 | DIO12 | DIO21 | DIO13 | DIO19 | RST | DIO18 | TMS | DIO17/TDI | TCK | DIO16/TDO | 3V3 | DIO15/SBL | GND | DIO14 | t.me/deaxx | - | +